# Altium schematic sheet indicator_leds.SchDoc
size A; SheetNumber: 10; SheetTotal: 12
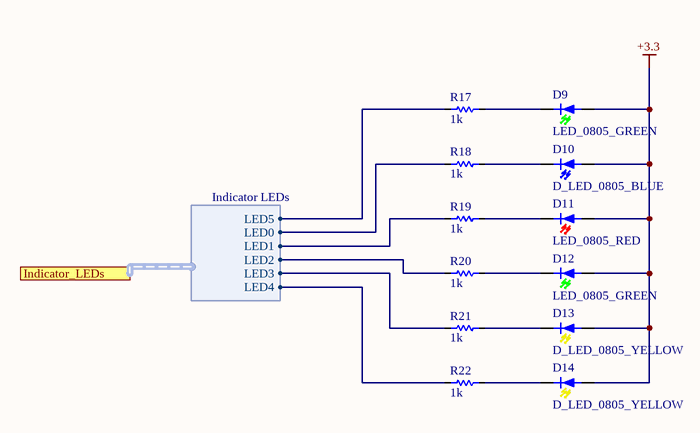
[diagram p0: indicator_leds.SchDoc]

## Parts
D9  LED_0805_GREEN  [0805_LED_Green]
D10  D_LED_0805_BLUE  [0805_LED_Blue]
D11  LED_0805_RED  [0805_LED_Red]
D12  LED_0805_GREEN  [0805_LED_Green]
D13  D_LED_0805_YELLOW  [0805_LED_Yellow]
D14  D_LED_0805_YELLOW  [0805_LED_Yellow]
R17  value 1k  [0603_RESISTOR]  (hidden comment: Res 0603 1K ohm 1%)
R18  value 1k  [0603_RESISTOR]  (hidden comment: Res 0603 1K ohm 1%)
R19  value 1k  [0603_RESISTOR]  (hidden comment: Res 0603 1K ohm 1%)
R20  value 1k  [0603_RESISTOR]  (hidden comment: Res 0603 1K ohm 1%)
R21  value 1k  [0603_RESISTOR]  (hidden comment: Res 0603 1K ohm 1%)
R22  value 1k  [0603_RESISTOR]  (hidden comment: Res 0603 1K ohm 1%)

## Ports
Indicator_LEDs (harness Indicator LEDs, see MPPT[3C], MicroController[5B])

## Harnesses
Indicator LEDs: LED0, LED1, LED2, LED3, LED4, LED5

## Nets
+3.3: D9.1(Anode) D10.1(Anode) D11.1(Anode) D12.1(Anode) D13.1(Anode) D14.1(Anode)
NetD9_2: D9.2(Cathode) R17.2
NetD10_2: D10.2(Cathode) R18.2
NetD11_2: D11.2(Cathode) R19.2
NetD12_2: D12.2(Cathode) R20.2
NetD13_2: D13.2(Cathode) R21.2
NetD14_2: D14.2(Cathode) R22.2
NetR17_1: R17.1 ; port Indicator_LEDs.LED5
NetR18_1: R18.1 ; port Indicator_LEDs.LED0
NetR19_1: R19.1 ; port Indicator_LEDs.LED1
NetR20_1: R20.1 ; port Indicator_LEDs.LED2
NetR21_1: R21.1 ; port Indicator_LEDs.LED3
NetR22_1: R22.1 ; port Indicator_LEDs.LED4

## Library data of the parts
D9 D12 = CMP-151-000025-2: LED CHIPLED 570NM GREEN 0805 SMD; Manufacturer PN: LG R971-KN-1-0-20-R18; Manufacturer: Osram Opto Semiconductors Inc; Current: 20mA; Forward Voltage: 2.2V; SVP Creator: Nate Bolyard; Source: diode.SchLib; Package: 0805; Value: GREEN; Supplier PN: 475-1410-1-ND; Design Item ID: D_LED_0805_GREEN
D10 = CMP-151-000020-1: LED 2X1.2MM 470NM BL WTR CLR SMD; Manufacturer PN: APT2012QBC/D; Manufacturer: Kingbright; Forward Voltage: 3.3; SVP Creator: Jonathan Nutzmann; Value: BLUE; Current: 20mA; Design Item ID: D_LED_0805_BLUE; Source: diode.SchLib; Supplier PN: 754-1437-1-ND; Package: 0805
D11 = CMP-151-000016-5: LED CHIPLED 645NM RED DIFF 0805; Manufacturer: OSRAM Opto Semiconductors Inc; Manufacturer PN: LH R974-LP-1; SVP Creator: Jonathan Nutzmann; Forward Voltage: 1.8V; Current: 20mA; Package: 0805; Value: RED; Source: diode.SchLib; Design Item ID: D_LED_0805_RED
D13 D14 = CMP-151-000028-1: LED 595NM AMBER DIFF SMD 0805; Manufacturer PN: HSMA-C170; Manufacturer: Avago Technologies US Inc.; Forward Voltage: 1.9; Current: 20mA; SVP Creator: Jonathan Nutzmann; Source: diode.SchLib; Package: 0805; Supplier PN: 516-1431-1-ND; Value: Amber; Design Item ID: D_LED_0805_YELLOW
R17-R22 = CMP-058-000005-5: RES 1K OHM 1/16W 1% 0603 SMD; Power: 62.5mW; Case/Package: 0603; Mounting Technology: SMD; Pins: 2; Tolerance: 1%